# EAGLE board main (EAGLE 5.10)
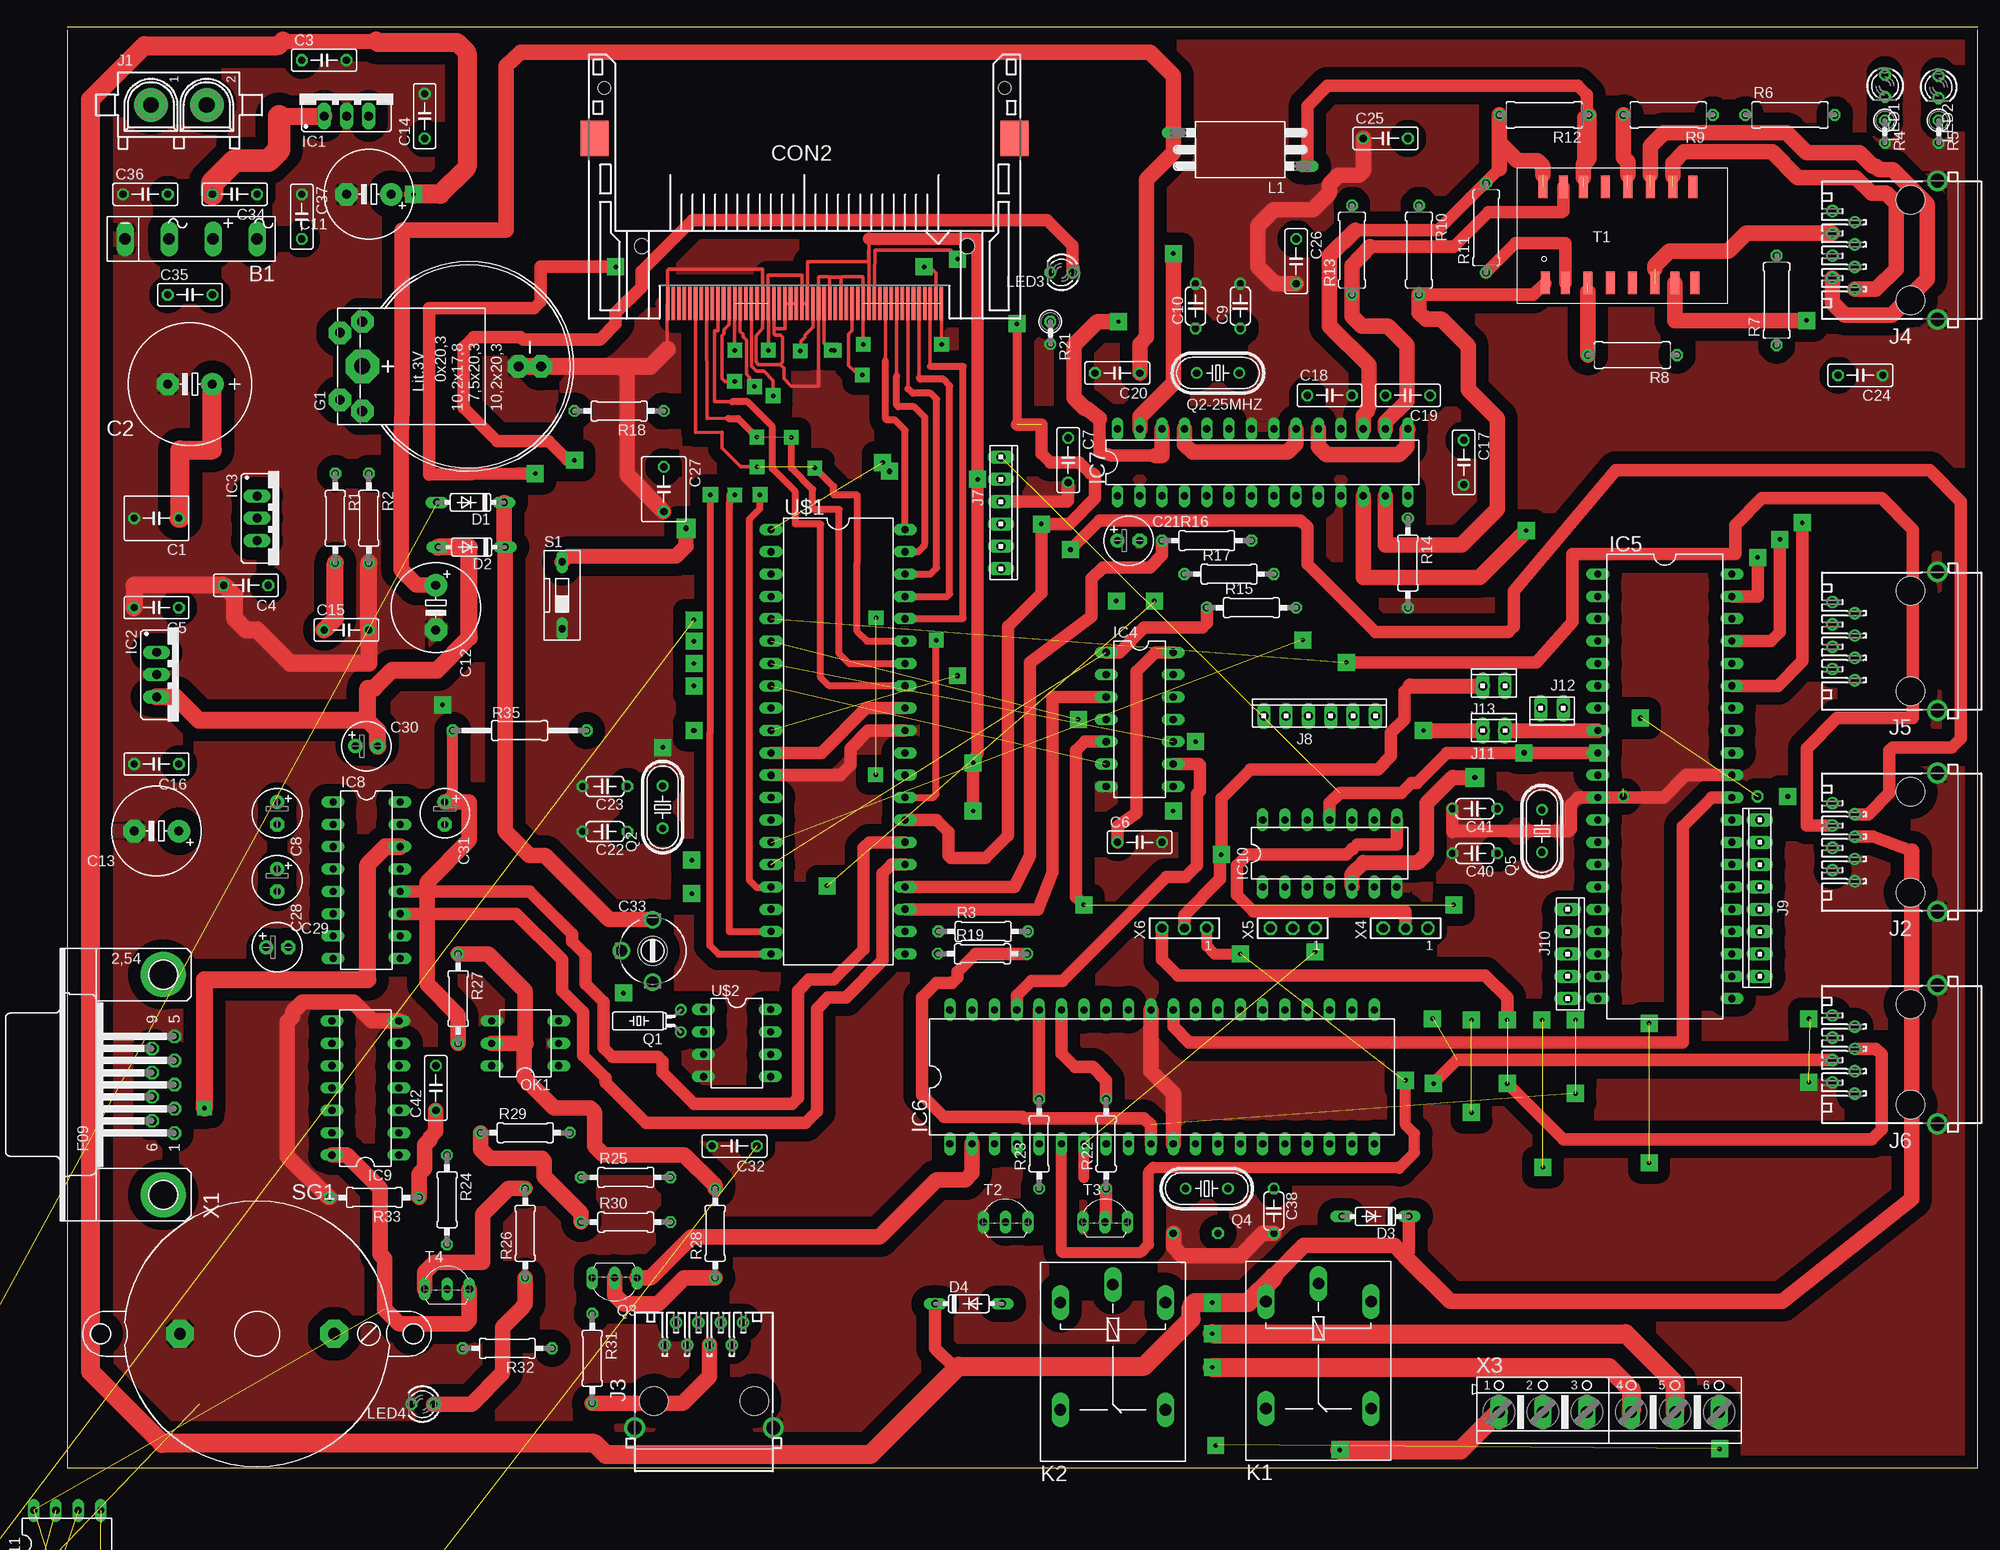
[diagram p5: board, top side]
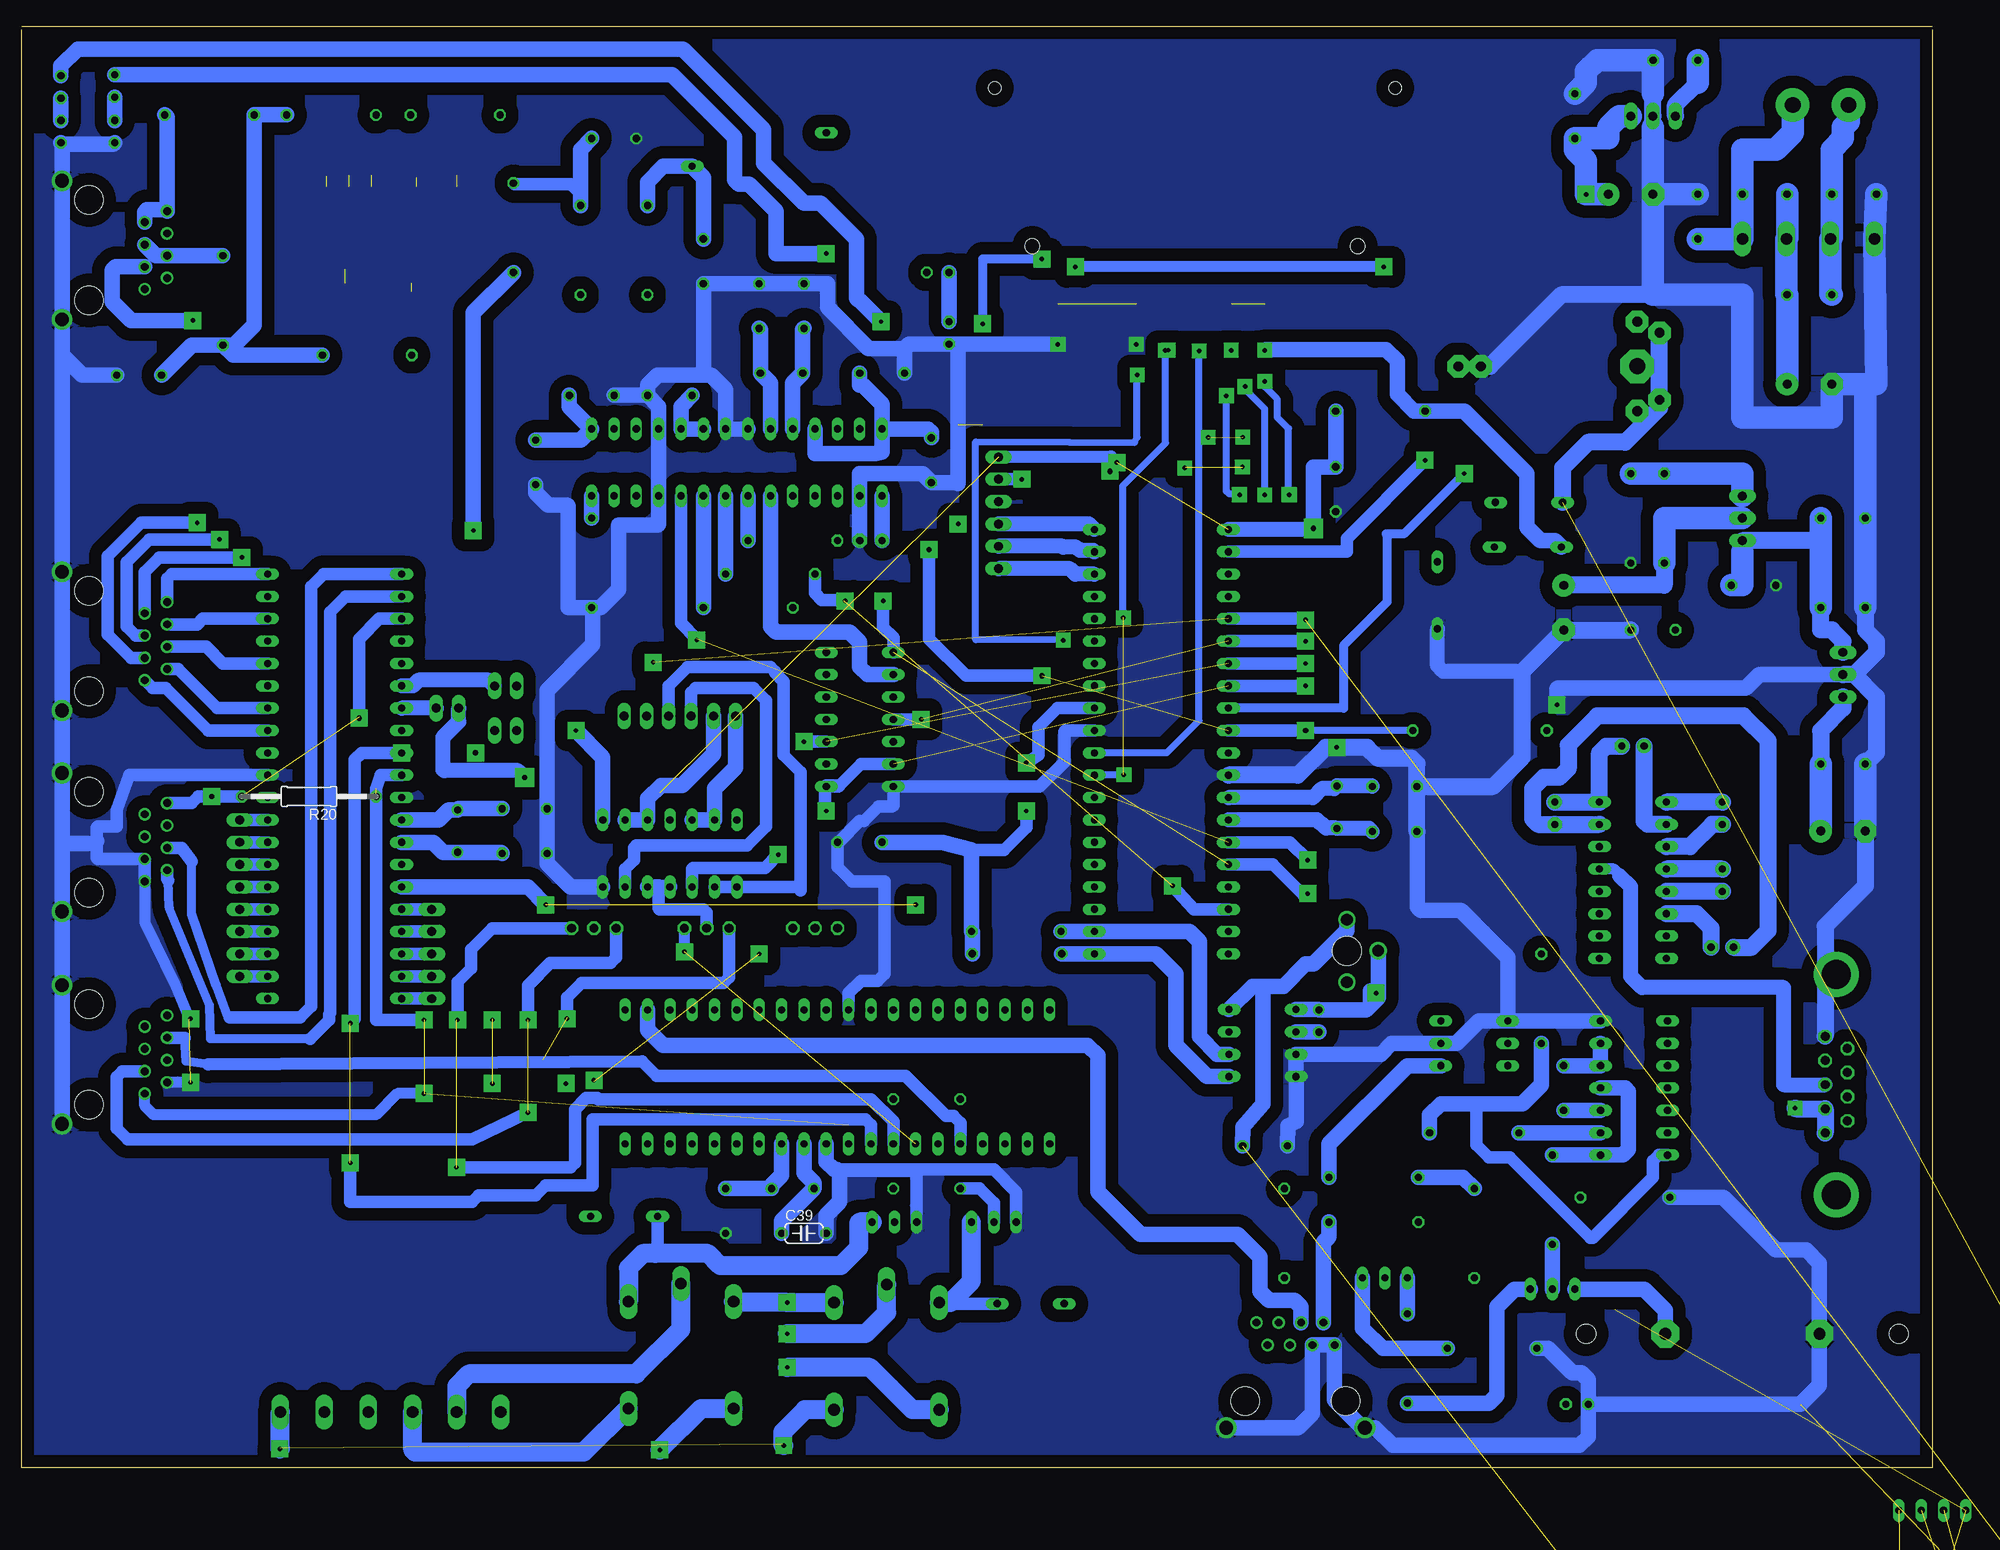
[diagram p6: board, bottom side, seen from below]

Size 217.15 x 163.83 mm. Coordinates in mm from the lower left corner, seen from the top.
Outline: 217.15,163.5 217.15,0 0,0 0,163.5
Outline: 0,163.83 217.15,163.83
Copper layers (1*16): Top 0.035mm / dielectric 1.5mm / Bottom 0.035mm
Design rules "default": minimum track width 10mil, minimum drill 24mil, track to track 8mil, track to pad 8mil, pad to pad 8mil, via to via 8mil, smd to smd 8mil, copper to edge 40mil, drill to drill 8mil, minimum pad ring 10mil, minimum via ring 8mil, stop-mask expansion 4mil, vias tented up to drill 0mil, thermal gap 10mil

## Footprints (pad centres in the part's own frame; a part is rotated, then mirrored left to right if it is on the bottom)
SKBB = drill 1.321 long: + -2.616,0; - 7.391,0; AC1 -7.62,0; AC2 2.388,0
C050-050X075 = drill 0.813 octagon: 1 -2.54,0; 2 2.54,0
E5-13 = drill 1.016 pad 2.54 round: + -2.54,0 | drill 1.016 pad 2.54 octagon: - 2.54,0
C050-025X075 = drill 0.813 octagon: 1 -2.54,0; 2 2.54,0
E2,5-6 = drill 0.813 pad 1.6 round: + -1.27,0 | drill 0.813 pad 1.6 octagon: - 1.27,0
C050-024X044 = drill 0.813 octagon: 1 -2.54,0; 2 2.54,0
E5-10,5 = drill 1.016 pad 2.54 round: + -2.54,0 | drill 1.016 pad 2.54 octagon: - 2.54,0
CTRIM808-1 = drill 1.321 round: 1 -3.556,0; 2 0,-3.556; 3 3.556,0 | hole 3.302: 0,0
C5B2.5 = drill 0.813 pad 1.6 octagon: 1 -2.54,0; 2 2.54,0
MI20-50PD-SF = smd 0.41 x 3.75: 1 15.557,-18.78; 2 14.287,-18.78; 3 13.018,-18.78; 4 11.748,-18.78; 5 10.477,-18.78; 6 9.207,-18.78; 7 7.938,-18.78; 8 6.668,-18.78; 9 5.397,-18.78; 10 4.128,-18.78; 11 2.857,-18.78; 12 1.587,-18.78; 13 0.318,-18.78; 14 -0.953,-18.78; 15 -2.223,-18.78; 16 -3.493,-18.78; 17 -4.763,-18.78; 18 -6.032,-18.78; 19 -7.303,-18.78; 20 -8.572,-18.78; 21 -9.842,-18.78; 22 -11.113,-18.78; 23 -12.383,-18.78; 24 -13.652,-18.78; 25 -14.922,-18.78; 26 14.922,-18.78; 27 13.652,-18.78; 28 12.383,-18.78; 29 11.113,-18.78; 30 9.842,-18.78; 31 8.572,-18.78; 32 7.303,-18.78; 33 6.032,-18.78; 34 4.763,-18.78; 35 3.493,-18.78; 36 2.223,-18.78; 37 0.953,-18.78; 38 -0.318,-18.78; 39 -1.587,-18.78; 40 -2.857,-18.78; 41 -4.128,-18.78; 42 -5.397,-18.78; 43 -6.668,-18.78; 44 -7.938,-18.78; 45 -9.207,-18.78; 46 -10.477,-18.78; 47 -11.748,-18.78; 48 -13.018,-18.78; 49 -14.287,-18.78; 50 -15.557,-18.78 | smd 3.2 x 4: M1 -23.883,-0.005; M2 23.883,-0.005 | hole 1.676: 18.5,-12.25; -18.5,-12.25 | hole 1.422: -22.75,5.75; 22.75,5.75
DO35-7 = drill 0.813 long: A 3.81,0; C -3.81,0
DO41-10 = drill 1.118 round: A 5.08,0; C -5.08,0
F126Z12 = drill 1.016 long: A 6.35,0; C -6.35,0
B2430UNI = drill 1.118 pad 2.54 octagon: + 3.81,14.605; +@1 -3.81,14.605; +@2 -5.08,12.065; +@3 5.08,12.065; - 0,-5.715; -@1 0,-8.255 | drill 1.803 pad 3.81 octagon: +@4 0,12.065
78XXS = drill 1.016 long: GND 0,-2.54; IN -2.54,-2.54; OUT 2.54,-2.54
317TS = drill 1.016 long: 1 -2.54,-2.54; 2 0,-2.54; 3 2.54,-2.54
DIL14 = drill 0.813 long: 1 -7.62,-3.81; 2 -5.08,-3.81; 3 -2.54,-3.81; 4 0,-3.81; 5 2.54,-3.81; 6 5.08,-3.81; 7 7.62,-3.81; 8 7.62,3.81; 9 5.08,3.81; 10 2.54,3.81; 11 0,3.81; 12 -2.54,3.81; 13 -5.08,3.81; 14 -7.62,3.81
DIL40 = drill 0.813 long: 1 -24.13,-7.62; 2 -21.59,-7.62; 3 -19.05,-7.62; 4 -16.51,-7.62; 5 -13.97,-7.62; 6 -11.43,-7.62; 7 -8.89,-7.62; 8 -6.35,-7.62; 9 -3.81,-7.62; 10 -1.27,-7.62; 11 1.27,-7.62; 12 3.81,-7.62; 13 6.35,-7.62; 14 8.89,-7.62; 15 11.43,-7.62; 16 13.97,-7.62; 17 16.51,-7.62; 18 19.05,-7.62; 19 21.59,-7.62; 20 24.13,-7.62; 21 24.13,7.62; 22 21.59,7.62; 23 19.05,7.62; 24 16.51,7.62; 25 13.97,7.62; 26 11.43,7.62; 27 8.89,7.62; 28 6.35,7.62; 29 3.81,7.62; 30 1.27,7.62; 31 -1.27,7.62; 32 -3.81,7.62; 33 -6.35,7.62; 34 -8.89,7.62; 35 -11.43,7.62; 36 -13.97,7.62; 37 -16.51,7.62; 38 -19.05,7.62; 39 -21.59,7.62; 40 -24.13,7.62
DIL28-3 = drill 0.813 long: 1 -16.51,-3.81; 2 -13.97,-3.81; 3 -11.43,-3.81; 4 -8.89,-3.81; 5 -6.35,-3.81; 6 -3.81,-3.81; 7 -1.27,-3.81; 8 1.27,-3.81; 9 3.81,-3.81; 10 6.35,-3.81; 11 8.89,-3.81; 12 11.43,-3.81; 13 13.97,-3.81; 14 16.51,-3.81; 15 16.51,3.81; 16 13.97,3.81; 17 11.43,3.81; 18 8.89,3.81; 19 6.35,3.81; 20 3.81,3.81; 21 1.27,3.81; 22 -1.27,3.81; 23 -3.81,3.81; 24 -6.35,3.81; 25 -8.89,3.81; 26 -11.43,3.81; 27 -13.97,3.81; 28 -16.51,3.81
DIL16 = drill 0.813 long: 1 -8.89,-3.81; 2 -6.35,-3.81; 3 -3.81,-3.81; 4 -1.27,-3.81; 5 1.27,-3.81; 6 3.81,-3.81; 7 6.35,-3.81; 8 8.89,-3.81; 9 8.89,3.81; 10 6.35,3.81; 11 3.81,3.81; 12 1.27,3.81; 13 -1.27,3.81; 14 -3.81,3.81; 15 -6.35,3.81; 16 -8.89,3.81
DIL-08 = drill 0.813 long: 1 -3.81,-3.81; 2 -1.27,-3.81; 3 1.27,-3.81; 4 3.81,-3.81; 5 3.81,3.81; 6 1.27,3.81; 7 -1.27,3.81; 8 -3.81,3.81
TO92- = drill 0.813 octagon: 1 -2.54,0; 2 0,0; 3 2.54,0
DIL8 = drill 0.8 long: P1 -3.81,2.54; P2 -1.27,2.54; P3 1.27,2.54; P4 3.81,2.54; P5 3.81,8.89; P6 1.27,8.89; P7 -1.27,8.89; P8 -3.81,8.89
350759-4 = drill 1.8 pad 3.81 round: 1 -3.175,0; 2 3.175,0
555153-1 = drill 0.889 round: 1 -4.445,6.35; 2 -3.175,8.89; 3 -1.905,6.35; 4 -0.635,8.89; 5 0.635,6.35; 6 1.905,8.89; 7 3.175,6.35; 8 4.445,8.89 | drill 1.575 pad 2.184 round: G1 -7.874,-3.048; G2 7.874,-3.048 | hole 3.251: -5.715,0; 5.715,0
10X06MTA = drill 1.016 long: 1 6.35,0; 2 3.81,0; 3 1.27,0; 4 -1.27,0; 5 -3.81,0; 6 -6.35,0
10X08MTA = drill 1.016 long: 1 8.89,0; 2 6.35,0; 3 3.81,0; 4 1.27,0; 5 -1.27,0; 6 -3.81,0; 7 -6.35,0; 8 -8.89,0
10X05MTA = drill 1.016 long: 1 5.08,0; 2 2.54,0; 3 0,0; 4 -2.54,0; 5 -5.08,0
10X02MTA = drill 1.016 long: 1 1.27,0; 2 -1.27,0
G5LE = drill 1.321 long: 1 -7.493,-5.969; 2 -7.493,5.969; O 4.699,5.969; P -9.525,0; S 4.699,-5.969
82114A = drill 0.813 long: 1 -7.62,1.905; 2 7.62,-1.905
LED3MM = drill 0.813 octagon: A -1.27,0; K 1.27,0
DIL06 = drill 0.813 long: 1 -2.54,-3.81; 2 0,-3.81; 3 2.54,-3.81; 4 2.54,3.81; 5 0,3.81; 6 -2.54,3.81
TO46-VT200 = drill 0.8 pad 1.4 round: 1 -1.27,0; 2 1.27,0
TC26H = drill 0.813 round: 1 -1.27,0; 2 1.27,0
HC49U-V = drill 0.813 round: 1 -2.413,0; 2 2.413,0
TO92-EBC = drill 0.813 long: B 0,-1.27; C -2.54,-1.27; E 2.54,-1.27
0207/10 = drill 0.813 octagon: 1 -5.08,0; 2 5.08,0
0207/2V = drill 0.813 octagon: 1 -1.27,0; 2 1.27,0
0309/10 = drill 0.813 octagon: 1 -5.08,0; 2 5.08,0
0207/15 = drill 0.813 octagon: 1 -7.62,0; 2 7.62,0
PT-10 = drill 1.016 pad 1.778 octagon: 1 -2.54,-5.08; 2 2.54,-5.08; 3 0,5.08
DS-01 = drill 0.813 long: 1 0,-3.81; 2 0,3.81
TL3XPO = drill 1.1 pad 1.422 long: 1 -2.54,0; 2 0,0; 3 2.54,0
F/BC35 = drill 1.321 pad 3.15 octagon: + 8.763,0; - -8.763,0 | hole 2.21: 17.78,0; -17.78,0
WE-LAN_7491010/3 = smd 1.02 x 2.54: 1 -5.964,14.042; 2 -3.678,14.042; 3 -1.138,14.042; 4 1.402,14.042; 5 3.942,14.042; 6 6.482,14.042; 7 8.768,14.042; 8 11.054,14.042; 10 8.504,24.964; 11 5.964,24.964; 12 3.424,24.964; 13 0.884,24.964; 14 -1.656,24.964; 15 -3.942,24.964; 16 -6.228,24.964;  10.79,24.964
TO92-EBC' = drill 0.813 long: B 0,-1.27; C 2.54,-1.27; E -2.54,-1.27
TO126 = drill 1.118 long: 1 -2.286,-5.08; 2 0,-5.08; 3 2.286,-5.08 | hole 3.302: 0,5.08
TO92 = drill 0.813 octagon: 1 1.27,0; 2 0,1.905; 3 -1.27,0
EE20-2 = drill 1.016 long: 1 -7.493,7.493; 4 -7.493,-7.493; 5 7.493,-7.493; 6 7.493,-2.515; 7 7.493,2.515; 8 7.493,7.493
DIL08 = drill 0.813 long: 1 -3.81,-3.81; 2 -1.27,-3.81; 3 1.27,-3.81; 4 3.81,-3.81; 5 3.81,3.81; 6 1.27,3.81; 7 -1.27,3.81; 8 -3.81,3.81
F09HP = drill 1.016 octagon: 1 -5.486,-1.27; 2 -2.743,-1.27; 3 0,-1.27; 4 2.743,-1.27; 5 5.486,-1.27; 6 -4.115,1.27; 7 -1.372,1.27; 8 1.372,1.27; 9 4.115,1.27 | drill 3.302 pad 5.08 round: G1 -12.522,0; G2 12.522,0
AK500/6 = drill 1.321 long: 1 -12.522,0; 2 -7.518,0; 3 -2.515,0; 4 2.515,0; 5 7.518,0; 6 12.522,0
TSW-103-02-S-S = drill 1 pad 1.5 octagon: 1 2.54,0; 2 0,0; 3 -2.54,0

## Placement (x,y rotation side)
B1  [SKBB]  13.97,139.7 180 top
C1  470n  [C050-050X075]  10.16,107.95 180 top
C2  2200u  [E5-13]  13.97,123.19 180 top
C3  100n  [C050-025X075]  29.21,160.02 0 top
C4  100n  [C050-025X075]  20.32,100.33 180 top
C5  100n  [C050-025X075]  10.16,97.79 180 top
C6  100n  [C050-025X075]  121.92,71.12 0 top
C7  100n  [C050-025X075]  113.79,114.55 270 top
C8  10u  [E2,5-6]  23.88,74.42 270 top
C9  15p  [C050-024X044]  133.35,132.08 90 top
C10  15p  [C050-024X044]  128.27,132.08 90 top
C11  470u  [E5-10,5]  34.29,144.78 180 top
C12  470u  [E5-10,5]  41.91,97.79 270 top
C13  470u  [E5-10,5]  10.16,72.39 180 top
C14  100n  [C050-025X075]  40.64,153.67 90 top
C15  100n  [C050-025X075]  31.75,95.25 0 top
C16  100n  [C050-025X075]  10.16,80.01 180 top
C17  100n  [C050-025X075]  158.75,114.3 270 top
C18  100n  [C050-025X075]  143.51,121.92 0 top
C19  100n  [C050-025X075]  152.4,121.92 180 top
C20  100n  [C050-025X075]  119.38,124.46 180 top
C21  10u  [E2,5-6]  120.65,105.41 0 top
C22  22p  [C050-024X044]  61.13,72.33 180 top
C23  22p  [C050-024X044]  61.13,77.47 180 top
C24  1n 1kV  [C050-025X075]  203.84,124.21 180 top
C25  100n  [C050-025X075]  149.86,151.13 0 top
C26  100n  [C050-025X075]  139.7,137.16 270 top
C27  220n  [C050-050X075]  67.82,111.25 270 top
C28  10u  [E2,5-6]  23.88,66.8 270 top
C29  10u  [E2,5-6]  23.88,59.18 0 top
C30  10u  [E2,5-6]  34.04,82.04 0 top
C31  10u  [E2,5-6]  42.93,74.42 270 top
C32  100n  [C050-025X075]  75.86,36.59 180 top
C33  [CTRIM808-1]  66.55,58.78 270 top
C34  1n  [C050-025X075]  19.05,144.78 180 top
C35  1n  [C050-025X075]  13.97,133.35 0 top
C36  1n  [C050-025X075]  8.89,144.78 0 top
C37  1n  [C050-025X075]  26.67,142.24 270 top
C38  22p  [C050-024X044]  137.16,29.21 270 top
C39  22p  [C050-024X044]  128.27,26.67 0 bottom
C40  22p  [C050-024X044]  160.02,69.85 180 top
C41  22p  [C050-024X044]  160.02,74.93 180 top
C42  100n  [C050-025X075]  41.91,43.18 90 top
C43  HUMIREL HS1100 Humidity Sensor  [CTRIM808-1]  -2.03,-38.86 0 top  (outside the outline)
C44  [C5B2.5]  -37.59,-55.12 0 top  (outside the outline)
C45  [C5B2.5]  -37.85,-60.2 0 top  (outside the outline)
C46  [C5B2.5]  -38.1,-70.36 0 top  (outside the outline)
C47  [C5B2.5]  -38.35,-75.44 0 top  (outside the outline)
C48  [C5B2.5]  -38.61,-87.88 0 top  (outside the outline)
C49  [C5B2.5]  -38.86,-100.33 0 top  (outside the outline)
C50  [C5B2.5]  -39.12,-112.78 0 top  (outside the outline)
C51  [C5B2.5]  -39.88,-137.67 0 top  (outside the outline)
CON2  [MI20-50PD-SF]  83.82,151.13 0 top
D1  1N4148DO35-7  [DO35-7]  45.85,109.75 180 top
D2  1N4148DO35-7  [DO35-7]  45.97,104.67 180 top
D3  1N4148DO35-7  [DO35-7]  148.72,28.58 180 top
D4  1N4148DO35-7  [DO35-7]  102.49,18.67 0 top
D5  1N4004  [DO41-10]  -26.42,-47.75 0 top  (outside the outline)
D6  1N4004  [DO41-10]  -36.07,-80.52 0 top  (outside the outline)
D7  1N4004  [DO41-10]  -36.32,-92.96 0 top  (outside the outline)
D8  1N4004  [DO41-10]  -36.58,-105.41 0 top  (outside the outline)
D9  1N4004  [DO41-10]  -36.83,-117.86 0 top  (outside the outline)
D10  1N4004  [DO41-10]  -37.34,-130.3 0 top  (outside the outline)
D11  ZD 4V7  [F126Z12]  -212.6,-293.37 0 top  (outside the outline)
G1  B2430UNI  [B2430UNI]  45.62,125.22 90 top
IC1  7812  [78XXS]  31.75,156.21 0 top
IC2  7805  [78XXS]  12.7,90.17 270 top
IC3  317T  [317TS]  24.13,107.95 270 top
IC4  74HCT125N  [DIL14]  121.92,85.09 270 top
IC5  MEGA32-P  [DIL40]  181.61,77.47 270 top
IC6  MEGA32-P  [DIL40]  124.46,44.45 0 top
IC7  ENC28J60SP  [DIL28-3]  135.89,114.3 0 top
IC8  MAX232_TI  [DIL16]  34.04,66.8 270 top
IC9  4011N  [DIL14]  33.91,43.18 90 top
IC10  74HCT08N  [DIL14]  143.51,69.85 0 top
IC11  NE555  [DIL-08]  0,-8.64 0 top  (outside the outline)
IC12  DS18B20  [TO92-]  -60.96,-169.42 0 top  (outside the outline)
IC13  DS18B20  [TO92-]  -61.21,-178.31 0 top  (outside the outline)
IC14  AD620  [DIL8]  -199.9,-269.75 0 top  (outside the outline)
J1  350759-4  [350759-4]  12.7,154.94 0 top
J2  [555153-1]  209.55,71.12 90 top
J3  [555153-1]  72.39,7.62 0 top
J4  [555153-1]  209.55,138.43 90 top
J5  [555153-1]  209.55,93.98 90 top
J6  [555153-1]  209.55,46.99 90 top
J7  [10X06MTA]  106.15,108.57 270 top
J8  [10X06MTA]  142.37,85.47 0 top
J9  [10X08MTA]  192.41,64.77 90 top
J10  [10X05MTA]  170.56,58.42 270 top
J11  [10X02MTA]  162.18,83.82 0 top
J12  [10X02MTA]  168.78,86.36 180 top
J13  [10X02MTA]  162.18,88.9 0 top
K1  G5L  [G5LE]  142.24,11.43 270 top
K2  G5L  [G5LE]  118.87,11.3 270 top
L1  82114A  [82114A]  133.35,149.86 180 top
LED1  [LED3MM]  206.63,157.1 270 top
LED2  [LED3MM]  212.72,156.97 270 top
LED3  [LED3MM]  113.03,135.89 180 top
LED4  [LED3MM]  40.39,7.24 180 top
OK1  4N37  [DIL06]  52.07,48.26 90 top
OK2  4N35  [DIL06]  -48.77,-151.13 0 top  (outside the outline)
PH1  VT20N1  [TO46-VT200]  -161.54,-248.67 0 top  (outside the outline)
PH2  VT20N1  [TO46-VT200]  -170.18,-248.67 0 top  (outside the outline)
PH3  VT20N1  [TO46-VT200]  -178.82,-248.67 0 top  (outside the outline)
PH4  VT20N1  [TO46-VT200]  -186.69,-248.67 0 top  (outside the outline)
PH5  VT20N1  [TO46-VT200]  -195.33,-248.67 0 top  (outside the outline)
PH6  VT20N1  [TO46-VT200]  -203.96,-248.67 0 top  (outside the outline)
Q1  [TC26H]  69.75,50.8 90 top
Q2  10MHZ  [HC49U-V]  67.69,75.11 90 top
Q2-25MHZ  [HC49U-V]  130.81,124.46 180 top
Q3  BC556  [TO92-EBC]  62.23,20.32 180 top
Q4  4 MHz  [HC49U-V]  129.54,31.75 180 top
Q5  16 MHz  [HC49U-V]  167.64,72.39 90 top
R1  [0207/10]  30.48,107.95 270 top
R2  [0207/10]  34.29,107.95 270 top
R3  [0207/10]  104.13,60.97 0 top
R4  330R  [0207/2V]  206.63,151.89 270 top
R5  330R  [0207/2V]  212.72,151.89 270 top
R6  75R  [0309/10]  195.83,153.8 0 top
R7  75R  [0309/10]  194.31,132.72 90 top
R8  75R  [0309/10]  177.93,126.49 180 top
R9  75R  [0309/10]  181.99,153.8 180 top
R10  49.9R 1%  [0309/10]  153.67,138.43 270 top
R11  49.9R 1%  [0309/10]  161.29,140.97 90 top
R12  49.9R 1%  [0309/10]  167.89,153.8 180 top
R13  49.9R 1%  [0309/10]  146.05,138.43 90 top
R14  [0207/10]  152.4,102.87 270 top
R15  [0207/10]  134.62,97.79 0 top
R16  [0207/10]  129.54,105.41 0 top
R17  [0207/10]  132.08,101.6 0 top
R18  1K  [0207/10]  62.74,120.14 180 top
R19  [0207/10]  104.05,58.45 0 top
R20  1K  [0207/15]  184.53,76.33 180 bottom
R21  330R  [0207/2V]  111.76,129.03 270 top
R22  1K  [0207/10]  118.11,36.83 90 top
R23  1K  [0207/10]  110.49,36.83 90 top
R24  1K  [0207/10]  43.18,30.48 270 top
R25  220R  [0207/10]  63.5,33.02 0 top
R26  560R  [0207/10]  52.07,26.67 90 top
R27  4K7  [0207/10]  44.45,53.34 270 top
R28  100R  [0207/10]  73.66,26.67 90 top
R29  3M  [0207/10]  52.07,38.1 0 top
R30  68K  [0207/10]  63.5,27.94 0 top
R31  330R  [0207/10]  59.69,12.45 270 top
R32  4K7  [0207/10]  50.04,13.59 180 top
R33  510K  [0207/10]  34.92,30.73 180 top
R34  1K  [0207/15]  1.52,-18.29 0 top  (outside the outline)
R35  1K  [0207/15]  51.44,83.82 0 top
R36  536K  [0207/15]  1.27,-23.11 0 top  (outside the outline)
R37  49.9K  [0207/10]  -1.52,-28.19 0 top  (outside the outline)
R38  49.9K  [0207/10]  -1.78,-33.27 0 top  (outside the outline)
R39  130K  [0207/10]  -35.56,-65.28 0 top  (outside the outline)
R40  130K  [0207/10]  -37.08,-125.22 0 top  (outside the outline)
R41  330R  [0207/10]  -38.1,-155.45 0 top  (outside the outline)
R42  4K7  [0207/10]  -49.02,-161.04 0 top  (outside the outline)
R43  1K  [0207/10]  -49.53,-171.7 0 top  (outside the outline)
R44  4K7  [0207/10]  -58.93,-185.67 0 top  (outside the outline)
R45  4K7  [0207/10]  -59.18,-190.75 0 top  (outside the outline)
R47  4K7  [0207/10]  -148.34,-211.84 0 top  (outside the outline)
R48  4K7  [0207/10]  -148.59,-216.92 0 top  (outside the outline)
R49  4K7  [0207/10]  -148.84,-222 0 top  (outside the outline)
R50  4K7  [0207/10]  -149.1,-227.08 0 top  (outside the outline)
R51  4K7  [0207/10]  -149.35,-232.16 0 top  (outside the outline)
R52  4K7  [0207/10]  -149.61,-237.24 0 top  (outside the outline)
R53  4K7  [0207/10]  -149.86,-242.32 0 top  (outside the outline)
R54  4K7  [0207/10]  -150.11,-247.4 0 top  (outside the outline)
R55  6K8  [0207/10]  -150.11,-251.97 0 top  (outside the outline)
R56  [0207/10]  -201.68,-257.05 0 top  (outside the outline)
R57  330R  [0207/2V]  -205.49,-274.32 0 top  (outside the outline)
R58  [PT-10]  -214.38,-269.24 0 top  (outside the outline)
R59  4K7  [0207/2V]  -217.42,-280.42 0 top  (outside the outline)
S1  [DS-01]  56.26,99.19 0 top
S2  TL36PO  [TL3XPO]  -71.88,-202.69 0 top  (outside the outline)
S3  TL36PO  [TL3XPO]  -82.8,-202.69 0 top  (outside the outline)
S4  TL36PO  [TL3XPO]  -93.73,-202.69 0 top  (outside the outline)
S5  TL36PO  [TL3XPO]  -104.9,-202.69 0 top  (outside the outline)
S6  TL36PO  [TL3XPO]  -115.82,-202.69 0 top  (outside the outline)
S7  TL36PO  [TL3XPO]  -126.75,-202.69 0 top  (outside the outline)
S8  TL36PO  [TL3XPO]  -137.92,-202.69 0 top  (outside the outline)
S9  TL36PO  [TL3XPO]  -148.84,-202.69 0 top  (outside the outline)
SG1  F/BC35  [F/BC35]  21.59,15.24 0 top
T1  [WE-LAN_7491010/3]  173.99,120.65 0 top
T2  [TO92-EBC']  106.68,29.21 0 top
T3  [TO92-EBC']  117.98,29.21 0 top
T4  [TO92-EBC']  43.18,21.59 0 top
T5  BD139  [TO126]  -37.34,-44.45 0 top  (outside the outline)
T6  BC547  [TO92]  -52.58,-165.86 0 top  (outside the outline)
TR1  [EE20-2]  -20.32,-32 0 top  (outside the outline)
U$1  PIC18F4520-I/P  [DIL40]  87.63,82.55 270 top
U$2  PCF8583P  [DIL08]  76.14,48.29 270 top
X1  [F09HP]  10.92,43.56 90 top
X3  [AK500/6]  175.26,6.35 0 top
X4  TSW-103-02-S-S  [TSW-103-02-S-S]  152.15,61.34 0 top
X5  TSW-103-02-S-S  [TSW-103-02-S-S]  139.32,61.34 0 top
X6  TSW-103-02-S-S  [TSW-103-02-S-S]  127,61.34 0 top

## Tracks (layer width: path | path; a pad name or v marks a point on that pad's centre or on a via)
+3V3
  Top 1.778: C12.+ 39.75,100.33 37.97,102.11 37.97,117.22 38.1,120.4 38.1,140.72 49.91,140.72 49.91,159.38 51.56,160.91 123.06,160.91 125.73,158.24 L1.2 125.73,149.48 122.68,146.43 122.68,128.52 121.92,127.76 C20.1 | IC7.25 127,116.33 127.89,115.44 138.68,115.44 139.7,116.46 IC7.20 | IC7.19 142.24,116.08 143.13,115.19 151.38,115.19 152.27,116.08 152.27,117.98 IC7.15
  Top 1.93: C15.1 30.48,96.52 R1.2
  Bottom 1.778: C7.1 113.79,117.73 114.17,118.11 IC7.28 | IC7.28 119.38,120.9 121.54,123.06 121.92,123.06 C20.1 | C18.1 142.24,120.65 IC7.19 IC7.20 | IC7.25 127,115.7 126.87,115.57 127,115.32 120.14,115.32 119.38,115.44 IC7.28 | C17.1 153.67,116.84 IC7.15 154.94,120.65 C19.1
  Bottom 1.93: C12.+ 30.48,100.33 R1.2
  Bottom 2.54: IC3.2 30.48,107.95 R1.2
+5V  (via drill 0.5 pad 1.68, 0.5 pad 1.93)  (22 unrouted)
  Top 0.406: CON2.32 91.14,132.36 91.14,139.72 91.07,137.12 84.14,137.12 CON2.13 CON2.38 83.52,132.36 83.52,135.57 79.7,135.57 79.69,135.56 CON2.41 79.7,132.34 v79.7,127.05 79.7,127.04 | v75.88,127.05 CON2.44
  Top 1.27: R35.1 43.81,76.58 C31.+
  Top 1.422: C6.1 119.38,72.9 121.54,74.42 121.54,90.55 123.7,92.71 IC4.14 | R19.2 103.28,58.45 101.22,56.39 101.22,55.75 100.58,55.12 98.81,55.12 97.16,53.47 97.16,42.42 99.69,39.88 108.58,39.88 108.71,39.75 122.43,39.75 123.19,38.99 IC6.10 | U$1.32 90.81,86.36 85.72,81.28 U$1.11 | v103,74.68 v103,80.14 103.5,81.28 v103.5,112.4 103.5,139.7 91.14,139.72
  Top 1.778: R31.2 69.98,7.37 73.03,10.41 J3.5 | IC9.14 31.75,35.56 35.56,31.75 35.56,24.26 36.07,23.75 36.07,18.03 37.72,16.38 45.34,16.38 45.72,16.76 T4.C | R27.2 44.45,51.44 40.89,54.99 40.89,66.55 45.72,71.37 45.72,75.69 C31.+
  Top 1.93: C30.- 35.31,83.82 34.16,84.96 | 34.16,84.96 14.99,84.96 12.32,87.63 IC2.OUT | 34.16,84.96 34.16,88.65 34.92,88.65 36.96,90.68 42.04,90.68 45.72,94.36 45.72,104.65 42.19,104.65 D2.A
  Bottom 1.27: J6.1 203.2,41.15 202.18,40.13 176.91,40.13 174.5,42.55 v171.45,42.55
  Bottom 1.422: IC5.10 176.4,78.74 176.91,77.22 176.91,50.93 v171.45,50.93 171.32,50.93 | U$1.32 99.44,86.36 101.6,84.2 101.6,81.03 v103,80.14 | v103,74.68 103,72.77 105.54,70.23 108.95,70.23 109.21,69.98 | J7.5 103.64,112.38 103.63,112.4 v103.5,112.4 | 46.61,41.4 51.69,41.4 51.82,41.27 51.82,36.7 50.42,35.31 48.01,35.31 38.86,26.16 38.61,26.16 31.75,33.02 31.75,34.92 31.11,35.56 IC9.14
  Bottom 1.778: D2.A 42.9,105.41 44.58,105.41 46.1,106.93 46.1,113.03 53.21,120.14 R18.2 58.93,120.14 60.83,122.05 60.83,125.86 62.1,127.13 75.81,127.13 v75.88,127.05 | R19.2 109.13,60.9 R3.2 109.21,69.98 109.21,70.22 112.52,71.12 C6.1 | R29.2 57.15,40.13 55.88,41.4 46.61,41.4 44.45,43.56 R27.2 | T4.C 47.5,20.32 49.53,18.29 49.53,8.26 50.42,7.37 R31.2
  Bottom 1.93: IC2.OUT 10.16,86.36 12.7,83.82 C16.1 | C31.+ IC8.16 37.85,81.28 37.08,82.04 C30.-
  Bottom 2.54: C16.1 C13.+
+12V  (via drill 0.5 pad 1.93)
  Top 1.422: J2.5 205.23,71.75 209.68,70.1 | D4.C 98.68,13.59 101.03,11.24 | D3.C 152.53,24.64 152.02,24.13
  Top 1.676: 24.51,162.18 35.18,162.18
  Top 1.778: 209.68,70.1 209.68,30.61 194.94,18.92 157.23,18.92 152.02,24.13 150.88,25.27 140.59,25.27 137.16,21.84 137.16,21.72
  Top 2.184: v39.37,144.78 42.42,144.78 45.47,147.83 45.47,160.91 44.32,162.05 35.31,162.05 35.18,162.18 | 24.51,162.18 24,161.67 8.76,161.67 2.67,155.57 2.67,10.92 10.79,2.79 59.94,2.79 61.21,1.52 91.31,1.52 101.03,11.24 101.35,11.56 122.43,11.56 127.76,16.89 127.76,18.29 128.14,18.8 v130.18,18.8 134.24,18.8 137.16,21.72
  Bottom 2.184: K2.2 v130.18,18.8 136.14,18.8 K1.1
  Bottom 2.54: IC1.OUT 35.56,153.67 36.83,152.4 36.83,151.13 C14.1 40.64,149.86 39.37,148.59 v39.37,144.78 C11.+
ACT_TUBE  (1 unrouted)
AM-MISO  (via drill 0.5 pad 1.93)  (1 unrouted)
  Top 1.27: 115.57,33.02 IC6.7
  Bottom 1.27: v141.86,58.67 X5.1
AM-MOSI  (via drill 0.5 pad 1.93)  (1 unrouted)
  Top 1.27: 152.15,43.94 152.15,38.99 153.16,37.97 153.16,35.81 151.38,34.04 151.26,34.16 123.44,34.16 122.94,33.66 122.94,25.4 122.05,24.51 113.03,24.51 IC6.6 | X6.1 129.54,59.31 130.43,58.42 v133.35,58.42
AM-SCK  (via drill 0.5 pad 1.93)  (1 unrouted)
  Bottom 1.422: IC6.8 118.11,39.37 120.65,41.91 151.64,41.91 151.76,42.04 153.03,42.04 154.31,40.77 154.31,34.67 154.81,34.16 v167.77,34.16 | X4.1 163.7,61.34 166.12,58.93 166.12,56.77 167.64,55.24 167.64,51.05 167.77,50.93
AVCC
  Top 1.422: IC6.30 125.73,50.16 127.51,48.39 183.64,48.39 183.64,72.9 186.94,76.2 IC5.30
DALLAS_DQ  (via drill 0.6 pad 1.93)  (1 unrouted)
  Top 1.422: J2.7 204.72,74.3 207.14,76.71 207.14,81.53 207.52,81.91 214.25,81.91 215.26,82.93 215.26,109.85 211.71,113.41 176.02,113.41 164.47,99.69 164.47,95.63 163.83,95 148.72,95 140.97,102.74 140.97,106.93 140.21,107.7 117.35,107.7 v114.05,104.39
  Bottom 0.813: R35.2 71.37,83.82
  Bottom 1.422: v114.05,104.39 114.05,94.23 109.86,90.04 v101.22,90.04 | 71.37,83.82 U$1.10
DALLAS_DQ1  (1 unrouted)
DALLAS_DQ2  (1 unrouted)
EAST  (1 unrouted)
GND  (via drill 0.5 pad 1.68, 0.5 pad 1.93)  (26 unrouted)
  Top 0.406: 81.05,125.42 81.33,125.7 81.33,128.52 81.11,128.74 80.49,128.74 80.33,128.91 CON2.16 80.35,132.32 80.35,129.51 80.38,129.49 81.6,129.49 CON2.15 CON2.39 CON2.14 82.88,132.34 | 81.05,125.42 78.55,125.42 78.33,125.83 78.33,128.64 79.06,129.55 CON2.17 79.06,134.04 79.07,134.05 79.07,136.22 79.05,136.25 68.35,136.25 68.24,136.13 68.24,132.38 CON2.50 68.2,132.29 68.2,127.13 | 86.72,132.31 CON2.11 86.68,135.28 | v90.49,127.72 CON2.8 90.49,135.31 90.39,135.41 88.15,135.41 87.95,135.2 CON2.10 87.95,135.33 87.92,135.36 86.75,135.36 86.68,135.28 | CON2.1 99.4,132.32 v99.4,127.72 | 81.05,125.42 81.48,124.99 81.48,123.8 82.3,122.99 82.88,122.99 82.92,122.95 85.39,122.95 85.41,122.96 CON2.12 85.41,135.34 85.5,135.43 86.53,135.43 86.68,135.28
  Top 1.422: U$1.31 91.06,83.82 89.03,81.79 89.03,79.88 87.88,78.74 U$1.12 | IC5.31 184.02,78.74 181.48,76.2 IC5.11 171.7,76.2 170.94,75.44 170.94,72.64 170.69,72.39 157.61,72.39 157.48,72.26 C41.2 | J7.4 113.65,109.84 113.79,109.98 C7.2
  Top 1.778: C27.2 63.63,112.9 63.63,124.46 62.87,125.22 | R33.2 29.72,30.73 25.02,35.43 25.02,50.67 25.65,51.31 25.65,51.82 26.8,52.96 32.51,52.96 34.67,50.8 IC9.7 | C26.2 137.29,134.62 135.38,136.53 135.38,141.22 137.16,143 141.6,143 143.51,144.91 143.51,145.92 144.53,146.94 146.81,146.94 147.32,147.45 C25.1 | C38.2 135.89,26.67 133.35,24.13 126.75,24.13 125.73,25.15 C39.2 | IC6.11 125.73,42.55 123.19,45.09 IC6.31
  Top 1.93: C5.2 7.62,100.33 C4.2 19.05,99.06 19.05,96.52 20.32,95.25 21.59,95.25 25.4,91.44 34.29,91.44 C15.2 R2.2 | G1.- 62.87,125.22 66.29,125.22 68.2,127.13
  Bottom 1.27: v197.99,43.81 J6.2 | J2.1 203.2,61.98 199.77,54.99 198.12,51.05
  Bottom 1.422: J2.1 J2.3 208.53,69.22 208.66,69.34 208.66,71.25 208.66,72.77 208.53,72.9 206.38,72.9 206.38,74.8 204.98,78.74 IC5.31 | IC6.31 123.19,53.98 121.79,55.37 119.89,55.37 119.13,56.13 119.13,66.67 122.81,66.67 124.46,68.33 C6.2 124.33,71.12 121.92,73.53 121.41,73.53 119.76,75.18 118.24,75.18 118.11,75.31 IC4.7 101.47,77.47 98.68,80.26 98.68,83.69 98.55,83.82 U$1.31 | T3.E 115.44,33.4 115.82,33.78 123.95,33.78 124.21,33.53 | T2.E 104.14,31.37 106.68,33.91 124.59,33.91
  Bottom 1.676: S1.1 56.26,91.19 55.63,90.55 46.86,90.55 46.61,90.3
  Bottom 1.778: IC2.GND 19.68,90.17 21.21,88.65 42.55,88.65 42.67,88.52 v42.67,86.74 | C32.2 73.27,38.88 72.26,39.37 72.26,44.41 U$2.4 U$2.3 62.71,47.02 61.47,48.26 OK1.2 54.1,48.26 51.56,50.8 OK1.4 | IC9.7 OK1.4 | OK1.4 48.26,58.04 53.59,63.37 58.17,63.37 58.55,63.75 58.55,72.29 C22.2 | R33.2 23.75,30.73 17.78,24.77 14.35,24.77 12.83,23.24 SG1.- 12.83,9.4 14.99,7.24 LED4.K | LED4.K 39.12,10.03 39.88,10.8 40.89,10.8 43.69,13.59 R32.2 | LED4.K 39.12,3.56 40.13,2.54 61.34,2.54 63.37,4.57 J3.G1 64.77,4.57 67.94,7.75 J3.1 J3.3 70.48,6.22 72.14,4.57 J3.G2 | 111,127.72 v99.4,127.72 | 111,127.72 111.72,127.72 R21.2 116.33,127.76 116.84,127.25 | 116.84,127.25 C20.2 | C21.- IC7.2 121.92,113.03 114.81,113.03 C7.2 110.87,112.01 110.74,111.89 110.74,127.47 111,127.72 | R14.2 151.38,97.79 149.35,99.82 149.35,107.19 144.91,107.19 144.78,107.31 IC7.11 IC7.18 144.78,120.65 C18.2 | C18.2 C19.2 | IC7.22 IC7.21 137.16,122.56 138.81,124.21 139.45,124.21 | 139.45,124.21 144.91,124.21 146.05,123.06 C18.2 | C17.2 158.75,110.87 157.35,109.47 155.19,109.47 155.07,109.35 155.07,97.79 R14.2 | 139.45,124.21 139.7,124.46 C26.2 C9.2 C10.2 125.6,134.62 125.6,131.95 120.9,127.25 116.84,127.25 | C24.1 210.31,124.21 212.6,126.49 | 212.6,126.49 J4.G1 J4.G2 212.6,150.5 | 212.6,150.5 R5.2 | 212.6,150.5 206.76,150.5 R4.2 | C39.2 125.73,28.7 124.21,30.23 124.21,33.53 124.59,33.91 124.84,33.91 125.73,34.8 IC6.11 | IC10.7 154.81,66.04 157.48,68.71 C40.2 C41.2 157.48,88.39 152.27,93.6 152.27,97.66 R14.2 | J6.G1 J6.G2 J2.G1 212.6,70.99 | 212.6,70.99 208.91,70.99 208.66,71.25 | 212.6,70.99 J2.G2 J5.G1 J5.G2 212.6,126.49
  Bottom 1.93: 31.75,156.21 IC1.GND 31.75,152.4 | 8.89,90.17 IC2.GND | 8.89,90.17 6.35,92.71 6.35,93.98 7.62,95.25 C5.2 | C16.2 6.35,81.28 6.35,87.63 8.89,90.17 | C15.2 C12.- 46.61,90.55 46.61,90.3 46.61,80.77 49.91,77.47 C23.2 | X1.5 12.19,61.59 7.62,66.17 C13.- | C22.2 C23.2 | C23.2 58.59,80.05 59.18,80.64 62.99,80.64 64.26,81.91 v67.69,81.91 68.96,81.91 72.14,78.74 U$1.12 | G1.- 50.29,125.22 42.16,133.35 31.88,133.35 31.75,133.48
  Bottom 2.54: 31.75,156.21 C3.2 38.1,160.02 39.37,158.75 39.37,157.48 C14.2 | C11.- 31.75,152.4 | C36.1 B1.- 6.35,123.19 7.62,123.19 | C11.- C37.1 | 7.62,123.19 C2.- 11.43,119.38 21.59,119.38 21.59,133.35 31.75,133.35 31.75,133.48 C11.- | 7.62,123.19 C1.2 C5.2 | C16.2 C13.-
  pour Bottom (isolate 1.422): -1.27,165.1 218.44,165.1 218.44,-1.27 -1.27,-1.27
  pour Top (isolate 1.422): 0,163.83 0,0 217.17,0 217.17,163.83
ICSP-MISO  (via drill 0.6 pad 2.18)
  Top 1.676: v160.02,78.49 157.48,78.49 154.56,75.56 154.56,69.85 153.54,68.83 147.32,68.83 146.05,67.56 IC10.5
  Bottom 1.422: X5.2 139.32,63.12 139.7,63.5 144.65,63.5 144.78,63.63 144.78,66.04
  Bottom 1.676: J12.1 167.51,84.84 169.29,83.06 169.29,79.38 169.16,79.25 160.78,79.25 v160.02,78.49 | IC10.5 144.78,66.04 IC10.4
ICSP-MISOCON
  Bottom 1.422: IC10.6 148.59,68.07 147.57,69.09 147.57,70.48 147.32,70.74 134.75,70.74 132.59,72.9 132.59,87.25 133.99,88.65 140.59,88.65 141.1,88.14 J8.4
ICSP-MOSI  (via drill 0.5 pad 1.93)
  Top 1.422: 152.65,88.9 152.02,88.27 152.02,85.09 150.5,83.57 150.5,80.9 148.97,79.38 134.49,79.38 131.19,76.07 v131.19,69.72 131.06,69.6 131.06,66.93 127,62.87 X6.2
  Top 1.676: 152.65,88.9 J13.2
  Bottom 1.422: IC10.3 140.97,68.07 140.84,68.2 132.72,68.2 v131.19,69.72
ICSP-MOSICON
  Bottom 1.422: IC10.1 IC10.2 129.03,66.04 128.65,65.66 128.65,79.12 130.56,81.03 130.56,89.41 131.57,90.42 131.57,90.55 132.08,91.06 141.48,91.06 143.64,88.9 J8.3
ICSP-SCK  (via drill 0.5 pad 1.93)
  Top 1.422: X4.2 152.15,63.25 134.87,63.25 132.97,65.15 132.97,68.45 134.24,69.72 145.41,69.72 146.05,70.36 146.18,70.36 146.69,70.87 151.13,70.87 IC10.8
  Top 1.676: v154.18,83.82 J11.2
  Bottom 1.778: IC10.8 151.13,80.77 v154.18,83.82
ICSP-SCKCON
  Bottom 1.778: J8.5 138.56,81.15 142.11,77.6 144.53,77.6 146.05,76.07 IC10.10 IC10.9
MEMS-CS
  Bottom 1.016: 195.96,45.85 198.5,46.23 198.63,48.89
  Bottom 1.422: 198.63,48.89 J6.6 | 195.96,45.85 146.69,46.23 145.03,44.58 116.71,44.58 112.14,40 111.25,40 110.49,39.24 IC6.5
MEMS-MISO  (via drill 0.5 pad 1.93)  (1 unrouted)
  Top 1.422: J6.4 157.99,46.36 v155.32,43.69
  Bottom 1.422: X5.3 136.78,55.75 137.41,55.12 153.54,55.12 155.19,53.47 155.19,51.18
MEMS-MOSI  (via drill 0.5 pad 1.93)  (1 unrouted)
  Top 1.422: J6.5 205.61,47.62 206.25,46.99 206.25,38.48 205.1,37.34 170.05,37.34 v163.7,43.69 | X6.3 124.46,57.78 126.24,56.01 161.16,56.01 163.7,53.47 163.7,51.05
MEMS-SCK  (via drill 0.5 pad 1.93)  (1 unrouted)
  Bottom 1.422: J6.3 205.74,45.09 206.38,44.45 206.38,38.61 205.1,37.34 165.99,37.34 v159.64,40.39 | X4.3 149.61,58.04 150.24,57.4 157.1,57.4 159.64,54.86 159.64,50.93
N$1
  Bottom 2.54: J1.2 15.88,151.76 17.78,149.86 21.59,149.86 C34.1 B1.AC1 C37.2
N$2
  Bottom 2.54: J1.1 9.53,153.03 10.16,152.4 10.16,151.13 11.43,149.86 C36.2 11.43,139.85 B1.AC2 11.58,133.5 C35.1
N$3
  Top 1.93: 24.13,153.67 IC1.IN
  Top 2.184: C2.+ 16.51,115.7 12.83,115.7 12.83,107.95 C1.1
  Top 2.54: C34.2 16.51,146.05 19.05,148.59 22.86,148.59 24.13,149.86 24.13,153.67
  Bottom 1.93: 26.67,157.48 29.21,154.94 IC1.IN | 12.7,105.41 IC3.3 21.59,104.14 | IC2.IN 10.16,93.98 11.43,95.25 12.7,95.25 C5.1
  Bottom 2.54: C34.2 16.51,139.78 B1.+ 16.59,133.43 C35.2 C2.+ | 26.67,157.48 C3.1 | C1.1 12.7,105.41 C5.1 | C4.1 21.59,100.33 21.59,104.14
N$4
  Top 1.422: U$1.23 110.36,63.5 112.01,67.69 112.01,87.63 IC4.3
N$5
  Bottom 2.54: IC3.1 21.59,113.03 R1.1 R2.1
N$6
  Bottom 1.778: R17.2 IC7.8
N$7
  Bottom 1.778: IC7.23 132.08,123.32 Q2-25MHZ.1 133.22,129.41 C9.1
N$8  (1 unrouted)
  Bottom 1.422: R17.1 127,99.44 126.24,98.68 123.83,98.68 123.7,98.55 | U$1.18 83.95,63.5 86.36,66.17
N$9
  Bottom 1.778: IC7.24 129.54,123.32 Q2-25MHZ.2 128.4,129.41 C10.1
N$10  (1 unrouted)
  Top 1.778: J4.1 205.61,133.99 207.9,136.27 207.9,143.76 206.76,144.91 205.1,144.91 203.33,146.69 196.72,146.69 193.8,149.61 183.77,149.61 182.5,148.34 182.5,146.81
N$11  (via drill 0.5 pad 1.93)
  Top 1.778: v125.73,138.05 125.73,123.32 121.92,119.51 IC7.27
  Bottom 1.778: LED1.A 143.26,158.37 136.14,151.26 136.14,146.43 135.64,145.92 134.49,145.92 131.44,142.88 131.44,138.05 v125.73,138.05
N$12  (via drill 0.5 pad 1.93)
  Top 1.422: 117.35,119.25 117.35,115.44 118.75,115.06 123.7,115.06
  Top 1.778: v119.51,130.3 117.09,130.3 114.43,127.64 114.43,121.67 115.7,120.4 115.95,120.4 117.35,119.25 | 123.7,115.06 124.46,115.06 IC7.26
  Bottom 1.778: LED2.A 212.72,159.38 210.82,161.29 141.99,161.29 132.84,152.15 132.84,148.34 128.27,143.76 126.36,143.76 122.3,139.7 122.3,132.97 122.05,132.72 121.92,132.72 v119.51,130.3
N$13
  Bottom 1.778: R4.1 LED1.K
N$14
  Bottom 1.778: R5.1 LED2.K
N$15
  Bottom 1.778: C21.+ IC7.1
N$16
  Bottom 1.778: R14.1 IC7.14
N$17
  Bottom 1.778: IC4.2 121.03,90.17 121.92,91.06 121.92,93.85 123.06,95 131.44,95 132.08,95.63 IC7.6
N$18
  Bottom 1.778: R15.2 IC7.9
N$19  (1 unrouted)
  Bottom 1.422: IC7.10 142.24,96.01 140.46,94.23 | U$1.15 73.03,71.12 70.99,69.09
N$20  (1 unrouted)
  Top 1.422: IC4.1 119.63,92.71 122.43,95.5 129.03,95.5 129.54,96.01 R15.1
  Bottom 1.422: U$1.16 74.93,68.58 71.5,65.15 70.74,65.15 | IC4.1 118.11,94.36 119.25,95.5 119.25,98.55
N$21  (1 unrouted)
  Top 1.778: J4.2 200.66,132.46 202.06,131.06 207.39,131.06 211.46,135.13 211.46,143.64 207.52,147.57 205.99,147.57 205.61,147.95 205.23,147.95 203.71,149.48 197.74,149.48 195.45,151.76 181.48,151.76 179.96,150.24 179.96,146.94
N$22
  Bottom 1.778: R16.2 IC7.7
N$23
  Top 1.422: U$1.24 107.7,66.04 109.47,69.6 109.47,91.57 116.46,96.77 116.46,101.09 117.73,102.36 123.06,102.36 124.46,103.76 R16.1
N$24
  Bottom 1.676: U$1.14 69.95,73.66 69.57,73.28 69.47,73.28 68.91,72.72 67.72,72.72 Q2.1 64.03,72.69 C22.1
N$25
  Bottom 1.676: U$1.13 70.42,76.2 69.42,77.2 68.01,77.2 Q2.2 63.72,77.52 C23.1
N$26
  Top 1.422: IC6.37 107.95,53.72 109.6,55.37 113.16,55.37 124.97,67.18 127.13,67.18 128.4,68.45 128.4,76.58 128.78,76.96 128.78,79.88 128.65,80.01 IC4.9
N$27  (via drill 0.5 pad 1.68)
  Top 1.93: v15.62,40.89 15.62,55.5 34.16,55.5 34.16,68.58 36.2,70.61 IC8.14
  Bottom 1.93: X1.1 X1.2 15.54,40.82 v15.62,40.89
N$28  (1 unrouted)
  Bottom 1.93: G1.+ 31.01,121.31 30.99,121.28 30.99,120.52 34.92,116.59 39.12,116.59 42.04,113.66 D1.A
N$29  (via drill 0.5 pad 1.93)
  other vias: 155.19,51.05
N$30
  Bottom 1.778: U$2.1 69.77,52.09 Q1.2 64.39,52.07 62.99,53.47 C33.2
N$31
  Bottom 1.778: U$2.2 69.77,49.55 Q1.1
N$32  (1 unrouted)
  Top 1.778: D1.C 49.66,104.8 D2.C 49.78,72.39 52.58,69.6 54.36,69.6 61.59,62.36 66.52,62.36 C33.1
  Bottom 1.778: C33.1 66.55,61.09 70.36,57.28 71.25,57.28 73.79,54.74 76.2,54.74 | 76.2,54.74 77.31,54.74 U$2.8 | C32.1 78.35,38.75 76.07,41.4 76.07,54.61 76.2,54.74
N$33
  Bottom 1.778: R21.1 LED3.K
N$34  (via drill 0.5 pad 1.93)
  Top 1.422: v57.66,114.55 56.9,114.55 54.74,116.71 48.9,116.71 45.09,120.52 45.09,127.38 46.23,128.52 51.56,128.52 51.82,128.27 60.58,128.27 62.36,130.05 62.36,131.32 65.28,134.24 65.28,136.02 71.12,141.86 111.38,141.86 114.3,138.94 LED3.A
  Bottom 1.422: U$1.2 66.55,104.14 66.55,105.66 v57.66,114.55
N$35  (via drill 0.5 pad 1.93)
  Top 1.778: T1.7 182.76,130.43 182.75,130.43 v197.74,130.43
  Bottom 1.778: v197.74,130.43 204.72,130.43 206.88,132.59 206.88,136.14 206.5,136.53 J4.3
N$36  (1 unrouted)
  Bottom 1.422: IC4.8 124.33,77.47 124.21,77.6 | IC4.6 121.79,80.01 124.21,77.6 | 124.21,77.6 125.73,77.6 125.86,77.47 125.86,74.8 125.73,74.68 | 71.25,88.9 U$1.8
N$37  (via drill 0.5 pad 1.93)  (1 unrouted)
  Bottom 1.422: IC4.10 v128.27,82.55 | 71.25,91.44 U$1.7
N$38  (1 unrouted)
  Top 1.778: J4.6 190.88,140.33 188.85,138.3 182.12,138.3 180.47,136.65 180.47,136.27
N$39  (1 unrouted)
  Top 1.778: R9.2 176.91,148.97 177.42,148.46 177.42,146.94
N$40  (1 unrouted)
  Bottom 1.422: 114.94,85.09 IC4.4 | 71.25,93.98 U$1.6
N$41
  Bottom 1.27: 35.56,67.31 35.56,67.44 36.2,68.07 IC8.13
  Bottom 1.676: X1.3 16.89,43.56 16.89,54.61 33.02,54.61 34.29,55.88 34.29,66.04 35.56,67.31
N$42
  Bottom 1.778: IC6.12 128.27,33.53 127.13,32.39 Q4.2 130.81,28.07 C39.1
N$43
  Bottom 1.778: IC6.13 130.81,33.27 131.95,32.13 Q4.1 C38.1
N$44  (1 unrouted)
  Top 1.778: R8.2 172.85,133.73
N$45
  Bottom 1.778: R7.2 J4.4 201.93,137.8 J4.5
N$46
  Bottom 1.778: IC5.12 169.8,73.66 168.66,74.8 Q5.2 167.51,74.93 C41.1
N$47
  Bottom 1.778: IC5.13 170.43,71.12 169.29,69.98 Q5.1 162.69,69.98 C40.1
N$48  (via drill 0.5 pad 1.93)
  other vias: 63.25,53.98
N$49
  Bottom 1.422: D3.A 144.91,24.64 145.16,24.38
  Bottom 2.184: K1.2 148.21,22.73 146.56,24.38 145.16,24.38 139.19,24.38 137.79,22.99 124.08,22.99 122.05,25.02 122.05,27.81 121.92,27.94 T3.C
N$50
  Bottom 1.422: D4.A 112.78,18.67 K2.1
  Bottom 2.184: K2.1 111.63,18.8 109.22,21.21 T2.C
N$51
  Top 1.422: R23.2 IC6.36
N$52
  Top 1.422: R22.2 118.11,44.07 116.59,45.59 114.55,45.59 113.03,47.12 IC6.35
N$53
  Top 1.422: R22.1 118.11,28.07 T3.B
N$54
  Bottom 1.422: R23.1 108.33,31.75 106.68,30.1 T2.B
N$55  (via drill 0.5 pad 1.93)
  Top 2.184: v144.65,2.03 158.42,2.03 X3.1
  Bottom 2.184: K1.S 139.95,6.73 v144.65,2.03
N$56
  Bottom 2.184: X3.2 167.74,9.3 166.37,10.67 147.32,10.67 142.24,15.75 K1.P
N$57
  Bottom 2.184: K1.O 148.34,6.73 153.29,1.78 172.47,1.78 172.72,2.03 172.72,6.33 X3.3
N$58  (via drill 0.5 pad 1.93)
  Top 2.184: v130.18,11.43 175.26,11.43 177.8,8.89 177.8,6.38 X3.4
  Bottom 2.184: K2.S 115.95,6.6 120.78,11.43 v130.18,11.43
N$59  (via drill 0.5 pad 1.93)
  Top 2.184: v130.18,15.24 177.16,15.24 182.75,9.65 182.75,6.38 X3.5
  Bottom 2.184: K2.P 118.87,17.65 121.28,15.24 v130.18,15.24
N$60
  Bottom 1.778: J4.7 203.2,142.75 202.95,143 200.79,143 J4.8 200.66,153.54 R6.2
N$61  (via drill 0.5 pad 1.93)  (1 unrouted)
  Bottom 2.184: X3.6 187.78,2.21 v187.83,2.16 | K2.O 128.14,6.6 130.68,4.06 130.68,2.67 130.56,2.54
N$62
  Bottom 1.778: R8.1 193.17,126.49 R7.1 | R7.1 197.87,127.64 C24.2 | R9.1 R6.1 190.75,129.92 193.04,127.64 R7.1
N$63
  Bottom 1.778: R24.1 IC9.1 35.18,35.56 34.54,36.2 34.54,42.8 34.92,43.18 IC9.4
N$64
  Bottom 1.778: T4.B R24.2
N$65
  Top 1.778: R30.1 58.42,28.96 54.23,33.15 54.23,34.92 53.98,35.18 48.01,35.18 46.99,36.2 R29.1
  Bottom 1.778: IC9.2 R29.1
N$66
  Bottom 1.422: R10.1 153.67,144.78 154.81,145.92 161.16,145.92 R11.2
  Bottom 1.778: R10.1 153.67,149.86 C25.2
N$67
  Top 1.778: R26.2 50.16,31.75 47.24,28.83 47.24,23.37 41.78,23.37 40.64,22.23 T4.E
  Bottom 1.778: T4.E 32.77,20.32 30.35,17.91 SG1.+ | R25.1 53.34,33.02 R26.2
N$68
  Top 1.778: LED4.A 45.97,7.24 49.53,10.8 49.53,16 51.82,18.29 51.82,18.41 52.07,18.67 R26.1
N$69
  Bottom 1.778: R25.2 68.58,36.83 59.69,45.72 OK1.1
N$70  (via drill 0.5 pad 1.68)
  other vias: 82.31,117.14
N$71
  Top 1.778: R27.1 47.88,58.42 52.07,54.23 52.07,48.39 52.2,48.26 | OK1.5 52.2,48.26 | R28.2 73.66,32.13 70.1,35.56 60.96,35.56 59.94,36.58 59.94,40.39 59.44,40.89 55.37,40.89 51.94,44.32 51.94,48.01 52.2,48.26
N$72
  Bottom 1.778: R31.1 Q3.E
N$73
  Top 1.778: Q3.C 66.29,21.59 70.99,26.29 92.33,26.29 98.81,32.77 102.11,32.77 102.87,33.53 IC6.2
  Bottom 1.778: R32.1 62.48,13.59 64.77,15.88 Q3.C
N$74
  Top 1.778: R28.1 70.1,21.59 67.18,18.67 63.25,18.67 62.23,19.69 Q3.B
N$75
  Bottom 1.778: IC9.6 IC9.5 C42.2
N$76
  Top 1.778: R33.1 40.01,33.4 40.64,34.04 40.64,36.7 41.27,37.34 41.27,37.59 41.91,38.23 C42.1
  Bottom 1.778: C42.1 IC9.3
N$77
  Bottom 1.93: C29.- 25.15,61.34 26.8,62.99 IC8.6
N$78  (1 unrouted)
  Top 1.422: 172.34,146.69 172.34,153.54 172.72,153.92 172.72,156.08 171.7,157.1 143.26,157.1 140.97,154.81 L1.1
  Top 1.778: R12.1 172.97,148.84 172.34,148.21 172.34,146.69
  Bottom 1.778: R13.2 146.05,146.18 144.27,147.95 L1.1 139.7,146.69 C26.1
N$79  (via drill 0.5 pad 1.68)
  other vias: 84.98,113.66
N$80
  Bottom 1.778: R30.2 68.58,26.29 69.22,25.65 J3.2
N$81
  Bottom 1.778: J3.4 71.75,18.29 72.52,19.05 75.44,19.05 76.45,20.07 76.45,24 78.99,26.54 90.04,26.54 94.87,31.37 94.87,46.86 96.01,48.01 144.27,48.01 146.05,49.78 IC6.22
N$82  (via drill 0.5 pad 1.93)  (1 unrouted)
  Top 1.422: IC4.5 115.7,82.55 114.68,81.53 114.68,64.9 115.57,64.01
  Bottom 1.778: IC5.15 159.64,66.04 v157.61,64.01
N$83  (via drill 0.5 pad 1.68)
  other vias: 75.87,123.52
N$84  (via drill 0.5 pad 1.68)
  other vias: 78.11,122.95
N$85  (via drill 0.5 pad 1.68)
  other vias: 80.25,121.88
N$86  (via drill 0.5 pad 1.68)
  other vias: 75.88,110.6
N$87  (via drill 0.5 pad 1.68)
  other vias: 73.09,110.62
N$88  (via drill 0.5 pad 1.68)
  other vias: 78.77,110.63
N$89
  Bottom 1.93: IC8.2 32.38,73.15 32.77,73.53 C30.+
N$90
  Bottom 1.93: C8.+ IC8.1
N$91  (via drill 0.5 pad 1.68)
  other vias: 83.35,126.99
N$92  (via drill 0.5 pad 1.68)
  other vias: 87.21,127.04
N$93
  Bottom 1.93: IC8.3 27.56,70.61 25.02,73.15 C8.-
N$94
  Bottom 1.93: C28.+ IC8.4
N$95  (via drill 0.5 pad 1.68)
  other vias: 91.9,78.8
N$96
  Bottom 1.93: C28.- IC8.5
N$97
  Bottom 1.422: J5.8 200.66,101.09 200.15,101.6 IC5.40
N$98  (via drill 0.5 pad 1.93)
  Top 1.422: v192.15,103.5 192.15,99.06 IC5.39
  Bottom 1.422: J5.7 203.2,101.85 201.55,103.5 v192.15,103.5
N$99
  Bottom 1.93: IC8.15 C31.- 44.83,73.15 45.47,73.79 45.47,77.22 44.2,78.49 42.42,78.49 41.4,79.5 41.4,82.17 38.1,85.47 21.46,85.47 18.67,82.68 18.67,61.09 20.57,59.18 C29.+
N$100
  Bottom 1.422: IC5.38 196.6,96.52 197.23,95.88 J5.6
N$101  (via drill 0.5 pad 1.93)
  Top 1.422: v194.69,105.54 194.69,95 193.68,93.98 IC5.37
  Bottom 1.422: J5.5 204.22,94.61 205.23,95.63 205.23,103 202.69,105.54 v194.69,105.54
N$102
  Bottom 1.422: J5.4 196.22,93.34 194.31,91.44 IC5.36
N$103  (via drill 0.5 pad 1.93)
  Top 1.422: v197.23,107.44 197.23,91.69 194.44,88.9 IC5.35
  Bottom 1.422: J5.3 204.72,92.08 207.39,94.74 207.39,103.63 203.58,107.44 v197.23,107.44
N$104
  Bottom 1.422: J5.2 199.39,90.81 194.94,86.36 IC5.34
N$105
  Bottom 1.422: IC5.33 195.96,83.82 200.79,88.65 202.31,88.65 J5.1
N$106
  Bottom 1.016: 184.4,48.77 195.71,48.77 195.83,52.58 200.41,63.63 200.53,66.8
  Bottom 1.422: 184.4,48.77 182.25,50.93 182.25,51.56 182.12,51.69 182.12,97.28 180.34,99.06 IC5.2 | 200.53,66.8 200.66,66.93 J2.2
N$107
  Bottom 1.016: 197.87,68.96 197.87,62.99 195.07,54.86 193.8,51.44 193.55,51.18
  Bottom 1.422: J2.4 199.01,70.48 197.87,68.96 | 193.55,51.18 185.55,51.18 184.28,52.45 184.28,100.2 182.88,101.6 IC5.1
N$108  (via drill 0.6 pad 1.93)
  other vias: 178.82,85.22
N$109  (via drill 0.6 pad 1.93)
  other vias: 71.25,83.82
N$110
  Bottom 1.778: 63.37,54.23 63.88,54.23 63.88,53.21
N$111
  Bottom 1.676: IC5.6 172.72,88.9 172.09,89.53 164.08,89.53 J13.1
N$112  (via drill 0.5 pad 1.93)
  other vias: 130.56,2.54
N$113
  Bottom 1.778: IC10.12 IC10.13 138.43,77.22 136.02,79.63 J8.6
N$114  (via drill 0.5 pad 1.93)
  other vias: 159.64,50.93
N$115  (via drill 0.5 pad 1.93)
  other vias: 163.7,50.93
N$116  (via drill 0.5 pad 1.93)
  other vias: 179.83,50.55
N$117  (via drill 0.5 pad 1.93)
  other vias: 167.64,50.93
N$118  (1 unrouted)
N$119
  Bottom 1.676: J12.2 IC5.7
N$120  (via drill 0.5 pad 1.93)
  other vias: 71.25,96.39
N$121  (via drill 0.5 pad 1.93)
  other vias: 140.46,94.11
N$122  (via drill 0.5 pad 1.93)
  other vias: 70.99,69.09
N$123
  Top 1.422: 107.95,118.62 110.74,118.62
N$124  (via drill 0.6 pad 1.93)
  other vias: 93.47,113.28
N$125  (via drill 0.5 pad 1.93)
  other vias: 152.15,44.07
N$126  (via drill 0.5 pad 1.93)
  other vias: 197.99,51.05
N$127  (via drill 0.5 pad 1.93)
  other vias: 115.57,64.01
N$128  (via drill 0.5 pad 1.93)
  other vias: 71.25,93.98
N$129  (via drill 0.5 pad 1.93)
  other vias: 114.94,85.09
N$130  (via drill 0.5 pad 1.93)
  other vias: 71.25,91.44
N$131  (via drill 0.5 pad 1.93)
  other vias: 125.73,74.68
N$132  (via drill 0.5 pad 1.93)
  other vias: 71.25,88.9
N$133  (via drill 0.5 pad 1.93)
  other vias: 70.99,65.28
N$134  (via drill 0.5 pad 1.93)
  other vias: 123.57,98.55
N$135  (via drill 0.5 pad 1.93)
  other vias: 119.25,98.55
N$136  (via drill 0.5 pad 1.93)
  other vias: 86.36,66.17
N$137
  Top 1.676: J11.1 IC5.8
N$138  (2 unrouted)
N$139
  Bottom 1.422: IC5.29 J9.1
N$140
  Bottom 1.422: IC5.28 J9.2
N$141
  Bottom 1.422: IC5.27 J9.3
N$142
  Bottom 1.422: IC5.26 J9.4
N$143
  Bottom 1.422: IC5.25 J9.5
N$144
  Bottom 1.422: IC5.24 J9.6
N$145
  Bottom 1.422: IC5.23 J9.7
N$146
  Bottom 1.422: IC5.22 J9.8
N$147  (3 unrouted)
N$148
  Bottom 1.422: J10.1 IC5.20
N$149
  Bottom 1.422: J10.2 IC5.19
N$150
  Bottom 1.422: J10.3 IC5.18
N$151
  Bottom 1.422: J10.4 IC5.17
N$152
  Bottom 1.422: J10.5 IC5.16
N$153  (2 unrouted)
N$154  (3 unrouted)
N$155  (1 unrouted)
N$156  (2 unrouted)
N$157  (1 unrouted)
N$158  (1 unrouted)
N$159  (3 unrouted)
N$160  (1 unrouted)
N$161  (3 unrouted)
N$162  (2 unrouted)
N$163  (2 unrouted)
N$164  (2 unrouted)
N$165  (1 unrouted)
N$166  (1 unrouted)
N$168  (1 unrouted)
N$169  (1 unrouted)
N$170  (1 unrouted)
N$171  (2 unrouted)
N$172  (2 unrouted)
N$174  (1 unrouted)
N$175  (1 unrouted)
N$176  (1 unrouted)
N$177  (4 unrouted)
N$178  (4 unrouted)
NORTH  (1 unrouted)
NORTH-EAST  (1 unrouted)
NORTH-WEST  (1 unrouted)
ONEWIRE1  (via drill 0.6 pad 1.93)  (1 unrouted)
  Bottom 1.422: J2.8 197.87,75.56 197.1,76.33 v195.58,76.33 R20.2 | IC5.3 176.53,96.52 178.82,94.23 178.82,85.34 178.69,85.22
RB0
  Top 0.406: CON2.21 74,132.35 74,129.27 73.6,129.27 73.6,129.02 73.6,121.18 74.98,121.2 75.59,121.2
  Top 0.813: 75.59,121.2 77.32,121.2 80.16,118.35 80.16,113.59 82.78,110.97 82.78,107.29 85.66,107.28 85.66,89.84 86.55,88.95 95.2,88.95 U$1.33
RB1  (via drill 0.5 pad 1.68)  (1 unrouted)
  Top 0.406: CON2.22 72.75,119.29 74.88,119.33 75.13,119.33 75.18,119.28
  Top 0.813: 75.18,119.28 76.28,119.28 v78.38,117.17 | U$1.34 88.88,91.44 87.76,92.56 87.76,108.95 84.73,108.95 84.73,111.21 82.32,113.63 82.32,117.12 82.31,117.13
RB2  (via drill 0.5 pad 1.68)  (1 unrouted)
  Top 0.406: CON2.23 71.44,117.67 74.45,117.72 74.45,115.9 76.53,113.82 78.4,113.82 v78.42,113.79
  Top 0.813: U$1.35 90.91,93.98 89.81,95.07 89.83,110.58 87.14,110.59 87.14,111.56 84.9,113.79
RB3
  Top 0.406: 98.09,125.21 98.09,132.34 CON2.2
  Top 0.813: U$1.36 97.79,96.52 101.85,96.56 101.85,125.2 98.09,125.21
RB4
  Top 0.406: 96.85,123.9 96.85,132.34 CON2.3
  Top 0.813: U$1.37 100.04,99.06 100.32,99.34 100.32,123.03 99.59,123.75 97,123.75 96.85,123.9
RB5
  Top 0.406: 95.58,122.68 95.58,132.34 CON2.4
  Top 0.813: U$1.38 98.13,101.6 98.83,102.3 98.83,121.47 98.15,122.16 96.1,122.16 95.58,122.68
  Bottom 1.676: J7.1 98.03,102.22 97.41,101.6 U$1.38
RB6
  Top 0.406: 94.3,124.12 CON2.5
  Top 0.813: U$1.39 96.77,104.14 97.26,104.62 97.26,104.65 97.41,104.8 97.41,104.91 97.51,105.02 97.51,119.39 96.29,120.61 94.47,120.61 94.3,120.79 94.3,124.12
  Bottom 1.676: J7.2 98.87,104.76 98.77,104.66 97.3,104.66 96.93,104.29 95.4,104.29 U$1.39
RB7
  Top 0.406: 92.99,125.83 92.99,126.21 93.03,126.25 CON2.6
  Top 0.813: U$1.40 95.25,117.96 94.09,119.11 93.17,119.11 93,119.28 93,125.82 92.99,125.83
  Bottom 1.676: J7.3 95.87,107.3 U$1.40
RC2  (via drill 0.5 pad 1.68)
  Top 0.406: CON2.18 77.79,125.23 78.37,124.65 79.23,124.65 80.26,123.62 80.26,121.87 v80.25,121.86
  Top 0.813: v78.74,110.63 78.74,109.03 77.55,107.84 77.55,66.8 78.37,65.98 79.95,65.98 U$1.17
  Bottom 0.813: v80.25,121.86 80.25,111.04 79.92,110.71 78.82,110.71 v78.74,110.63
RD0  (via drill 0.5 pad 1.68)
  Top 0.406: CON2.19 76.52,129.17 76.83,128.85 76.83,128.57 77.23,128.18 77.23,124.31 77.6,123.94 77.6,123.44 v78.13,122.91
  Top 0.813: v75.91,110.6 75.35,110.6 75.35,109.64 75.27,109.64 75.27,60.97 75.29,60.96 U$1.19
  Bottom 0.813: v78.13,122.91 78.13,122.61 75.88,120.36 75.88,110.63 v75.91,110.6
RD1  (via drill 0.5 pad 1.68)
  Top 0.406: CON2.20 75.25,129.95 74.68,129.38 74.68,128.92 74.47,128.72 74.47,123.84 74.8,123.51 75.87,123.51 v75.88,123.52
  Top 0.813: v73.13,110.63 73.13,83.6 73.08,83.55 73.08,59.38 74.04,58.42 U$1.20
  Bottom 0.813: v75.88,123.52 75.88,122.91 74.45,121.47 74.45,119.41 73.19,118.15 73.19,110.69 v73.13,110.63
RD4  (via drill 0.5 pad 1.93)  (1 unrouted)
  Top 0.406: CON2.7 91.76,135.32 91.82,138.43 100.46,138.43 v101.22,137.41
  Top 1.016: v107.95,130.05 107.95,118.62
  Top 1.422: U$1.27 98.81,73.66 100.2,72.26 100.2,69.6 100.46,69.34 104.39,69.34 106.93,71.88 106.93,95.63 110.74,99.44 v110.74,107.31 113.92,107.31 116.84,110.24 116.84,112.78 116.59,113.03 116.33,113.03 115.06,114.3 111.76,114.3 110.74,115.32 110.74,118.62
  Bottom 1.016: v101.22,137.41 107.95,137.41 v107.95,130.05
RD5  (via drill 0.5 pad 1.68)
  Top 0.406: CON2.9 89.22,129.26 88.84,128.88 88.84,125.3 89.48,124.65 89.99,124.65 v90.39,124.26
  Top 0.813: v98.79,94.09 98.79,76.59 98.4,76.2 U$1.28
  Bottom 0.813: v90.39,124.26 90.39,117.15 90.69,116.56 98.08,116.6 108.76,116.66 108.76,94.14 v98.79,94.09
RD6  (via drill 0.5 pad 1.68)  (1 unrouted)
  Top 0.406: CON2.36 86.04,127.88 v86.86,127.06
  Bottom 0.813: v86.86,127.06 87,127.06 87.16,126.9 87.16,116.51 92.02,111.65 92.02,96.7 v91.96,96.63 | U$1.29 92.01,78.74 91.94,78.82
RD7  (via drill 0.5 pad 1.68)
  Top 0.406: CON2.37 84.77,129.68 83.88,128.79 83.88,128.54 83.43,128.08 83.43,127.05 v83.35,126.97
  Bottom 0.813: v83.35,126.97 83.35,84.95 87.03,81.27 95.24,81.27 U$1.30
RE1  (via drill 0.5 pad 1.93)
  Top 0.406: CON2.26 98.74,135.83 98.04,136.53 v97.41,136.53
  Top 1.422: v53.21,113.03 51.18,113.03 41.15,112.9 41.15,131.83 53.09,131.83 53.85,132.59 53.85,136.53 v62.36,136.53
  Bottom 1.016: U$1.9 66.93,86.36 66.93,93.47 61.98,98.42 61.98,106.05 62.1,106.17 60.07,106.17 v53.21,113.03
  Bottom 1.27: v62.36,136.53 v97.41,136.53
RESET  (via drill 0.5 pad 1.93, 0.6 pad 1.93, 0.6 pad 2.18)  (3 unrouted)
  Top 1.422: IC5.9 v165.61,81.28 156.84,81.28 153.42,77.85 152.78,77.85 151.64,76.71 144.65,76.71 143.51,75.56 IC10.11
  Top 1.676: v70.36,106.81 70.36,104.78 69.22,103.63 56.9,103.63 S1.2
  Bottom 1.422: IC6.9 120.65,38.99 121.28,39.62 152.27,39.62 152.27,32.13 157.61,32.13 158.75,30.99 165.23,30.99 165.99,30.23 179.83,30.23 v179.83,34.67 | IC5.9 178.56,81.28 179.32,80.52 179.32,51.05 179.83,50.55 | J7.6 93.34,114.94 v92.71,114.3
  Bottom 1.676: U$1.1 70.48,106.68 v70.36,106.81 70.36,108.08
  Bottom 1.778: 70.36,108.08 70.36,113.79 C27.1 R18.1
  other vias: 173.99,81.28
RXD
  Top 1.422: U$1.26 91.19,71.12 90.55,70.48 90.55,58.93 87.12,55.5 84.33,55.5 83.06,54.23 83.06,42.04 82.42,41.4 71.25,41.4 67.69,44.96 67.69,46.23 67.18,46.74 61.98,46.74 60.96,47.75 60.96,52.96 58.93,54.99 58.93,58.29 57.4,59.82 57.4,60.71 52.58,65.53 IC8.12
SCL
  Bottom 1.778: U$2.6 81.31,47.02 83.31,49.02 83.31,59.82 84.45,60.96 U$1.22 95.26,60.97 R3.1
SDA
  Bottom 1.778: U$2.5 82.45,44.48 85.98,48.01 85.98,56.13 88.27,58.42 U$1.21 95.28,58.45 R19.1
SOUTH  (1 unrouted)
SOUTH-EAST  (1 unrouted)
SOUTH-WEST  (1 unrouted)
SP_SENSE  (via drill 0.5 pad 1.93)  (2 unrouted)
  Top 1.422: J2.6 197.74,73.03 197.74,81.79 201.17,85.22 209.8,85.22 209.8,106.68 206.25,110.24 192.66,110.24 189.61,107.19 189.61,103.89 171.07,103.89 171.07,96.14 167,91.57 v145.41,91.57
  Bottom 1.422: U$1.5 71.37,96.52 71.25,96.39
TPIN+
  Top 1.422: T1.1 166.68,133.35 R10.2
  Top 1.778: IC7.13 149.86,104.9 158.5,104.9 162.56,108.97 162.56,119.25 159.26,122.56 159.26,127.51 156.21,130.56 154.43,130.56 153.67,131.32 R10.2
TPIN-  (via drill 0.5 pad 1.93)
  Top 1.422: R11.1 164.59,139.19 170.31,139.19 T1.2
  Top 1.778: v165.86,106.55 160.53,101.22 147.32,101.22 IC7.12
  Bottom 1.778: R11.1 165.86,131.32 v165.86,106.55
TPOUT+  (1 unrouted)
  Top 1.422: 146.43,140.72 155.83,140.72 159.51,144.4 162.81,147.7
  Top 1.778: IC7.17 147.32,119.63 147.83,120.14 147.83,120.52 147.96,120.65 147.96,125.35 143.51,129.79 143.51,137.8 146.43,140.72 | 162.81,150.62 162.81,150.88 R12.2 | 162.81,150.62 164.85,148.59 167.13,148.59 167.77,147.95 167.77,146.94 | 162.81,147.7 162.81,150.62
TPOUT-
  Top 1.422: 148.08,138.81 157.61,138.81 161.54,142.75 169.93,142.75 170.05,142.87 T1.15
  Top 1.778: IC7.16 149.86,118.87 152.27,121.28 152.27,127.64 150.11,129.79 147.19,129.79 146.05,130.94 R13.1 146.05,136.65 148.08,138.81
TXD
  Top 1.422: U$1.25 93.73,68.58 92.71,67.56 92.71,57.66 88.52,53.47 86.49,53.47 85.22,52.2 85.22,40.51 83.95,39.24 65.79,39.24 61.21,43.81 61.21,44.32 58.67,46.86 58.67,51.82 56.26,54.23 56.26,57.78 51.05,62.99 IC8.11
WEST  (1 unrouted)